# Altium schematic sheet Sch_Sheet_Template.SchDoc: LED Board
size B; Date: MM/DD/YYYY; Author: LED Team; Organization: ORGANIZATION; Address1: ADDRESS 1; Address2: ADDRESS 2; Address3: ADDRESS 3; Address4: ADDRESS 4; Revision: -; SheetNumber: 1; SheetTotal: 1; ENG_APP_DATE: --/--/--; DSN_APP_DATE: --/--/--; CHK_APP_DATE: --/--/--
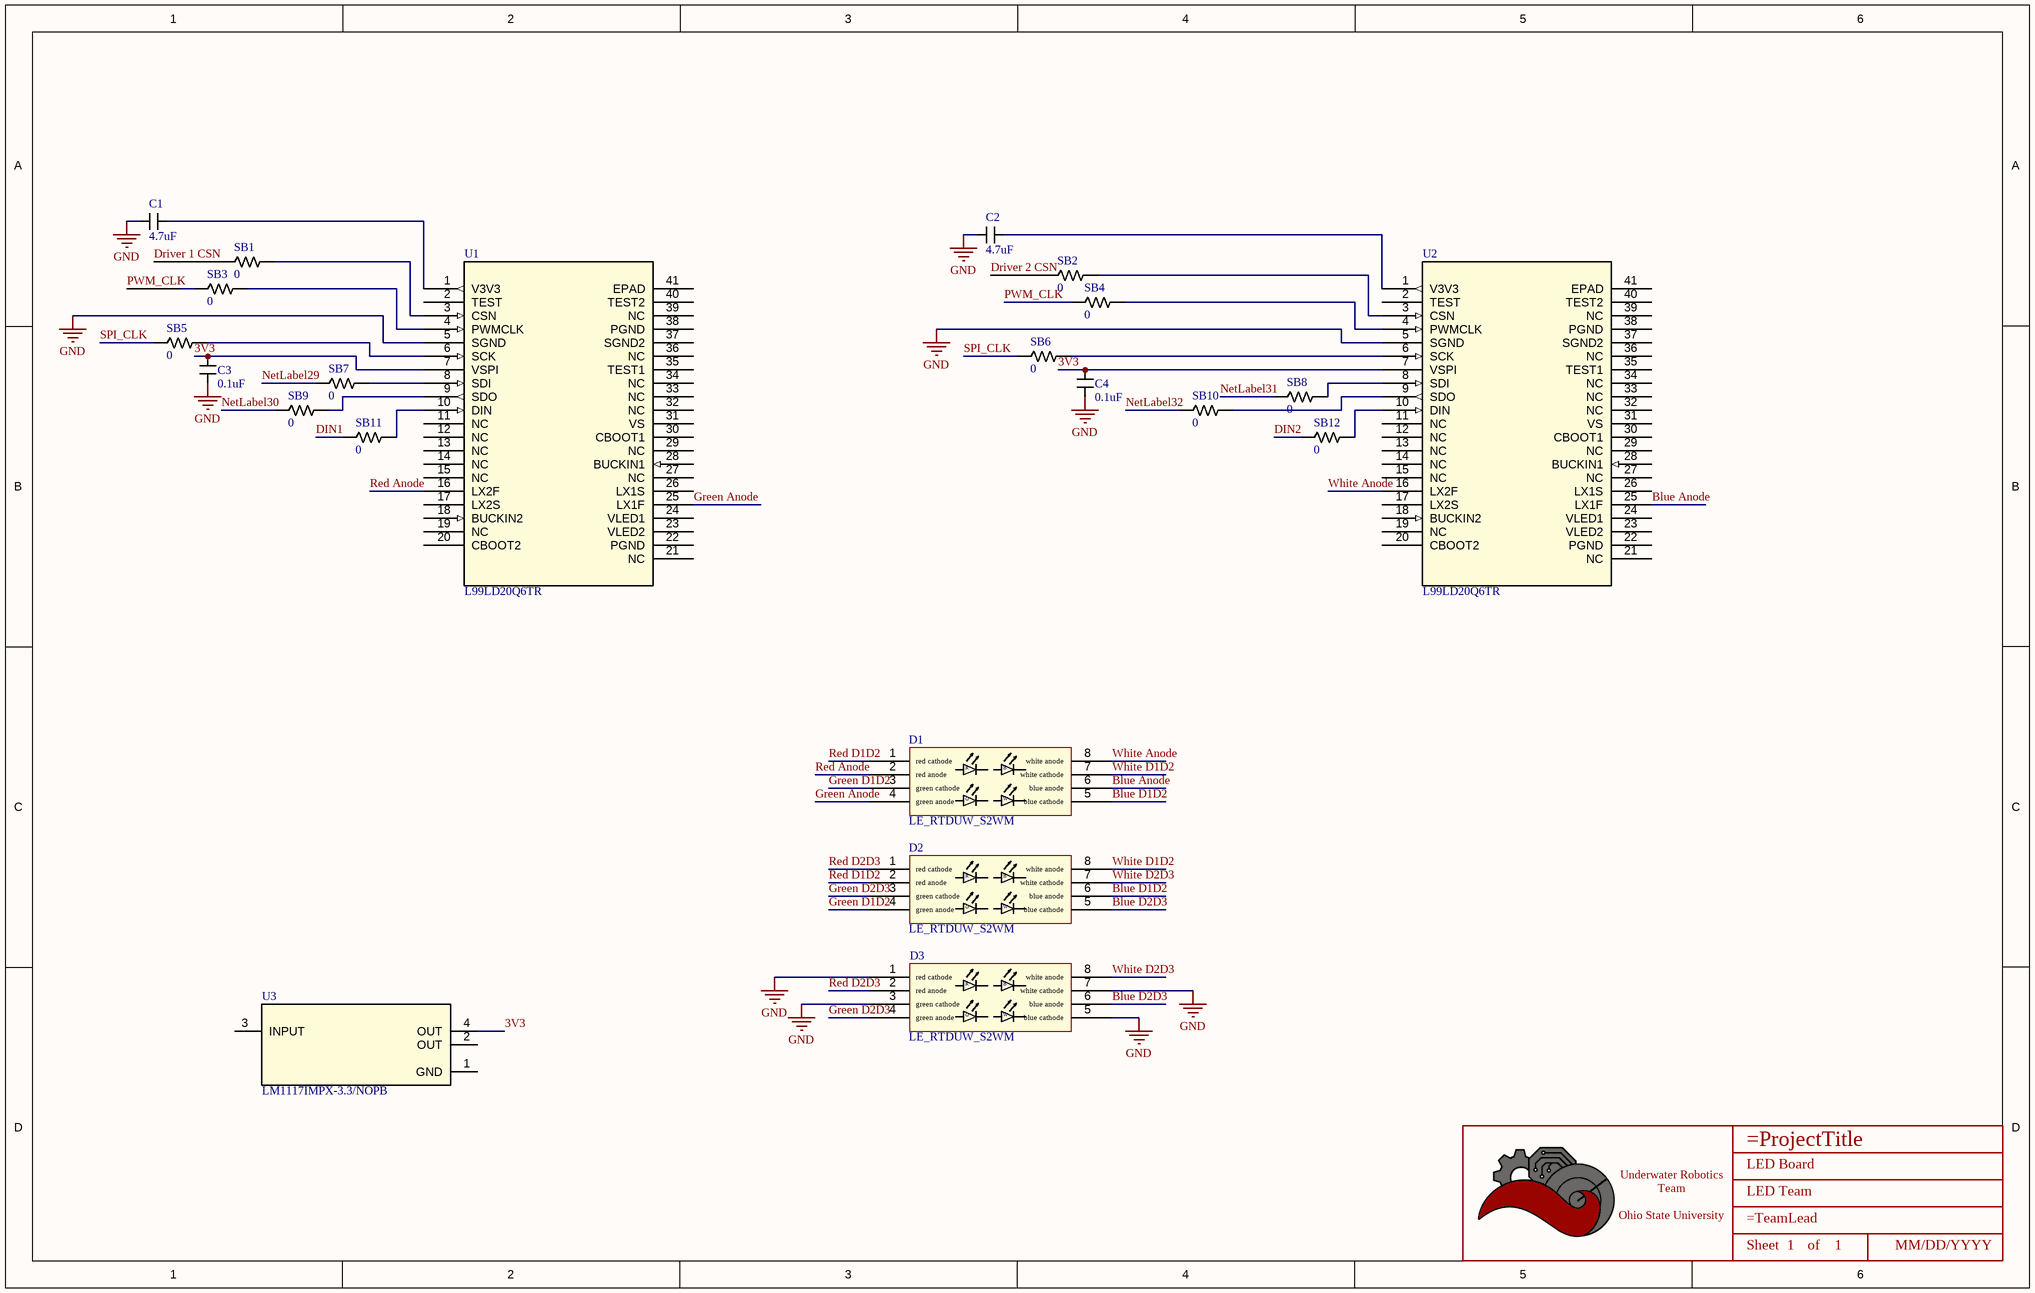
[diagram p0: Sch_Sheet_Template.SchDoc]

## Parts
*  Title_Block  [LOGO]  (value not drawn)  (graphical)
C1  value 4.7uF  [CAPACITOR_0603]  (hidden comment: 4.7uF Ceramic 6.3V)
C2  value 4.7uF  [CAPACITOR_0603]  (hidden comment: 4.7uF Ceramic 6.3V)
C3  value 0.1uF  [CAPACITOR_0603]  (hidden comment: 100nF Ceramic 6.3V)
C4  value 0.1uF  [CAPACITOR_0603]  (hidden comment: 100nF Ceramic 6.3V)
D1  LE_RTDUW_S2WM
D2  LE_RTDUW_S2WM
D3  LE_RTDUW_S2WM
SB1  Value  (Ohms): 0  [RESISTOR_0603]  (hidden comment: 0 Ohm Jumper No Fit)
SB2  Value  (Ohms): 0  [RESISTOR_0603]  (hidden comment: 0 Ohm Jumper No Fit)
SB3  Value  (Ohms): 0  [RESISTOR_0603]  (hidden comment: 0 Ohm Jumper No Fit)
SB4  Value  (Ohms): 0  [RESISTOR_0603]  (hidden comment: 0 Ohm Jumper No Fit)
SB5  Value  (Ohms): 0  [RESISTOR_0603]  (hidden comment: 0 Ohm Jumper No Fit)
SB6  Value  (Ohms): 0  [RESISTOR_0603]  (hidden comment: 0 Ohm Jumper No Fit)
SB7  Value  (Ohms): 0  [RESISTOR_0603]  (hidden comment: 0 Ohm Jumper No Fit)
SB8  Value  (Ohms): 0  [RESISTOR_0603]  (hidden comment: 0 Ohm Jumper No Fit)
SB9  Value  (Ohms): 0  [RESISTOR_0603]  (hidden comment: 0 Ohm Jumper No Fit)
SB10  Value  (Ohms): 0  [RESISTOR_0603]  (hidden comment: 0 Ohm Jumper No Fit)
SB11  Value  (Ohms): 0  [RESISTOR_0603]  (hidden comment: 0 Ohm Jumper No Fit)
SB12  Value  (Ohms): 0  [RESISTOR_0603]  (hidden comment: 0 Ohm Jumper No Fit)
U1  L99LD20Q6TR  [QFN40L_6P15X6P15X0P5_STM]
U2  L99LD20Q6TR  [QFN40L_6P15X6P15X0P5_STM]
U3  LM1117IMPX-3.3/NOPB  [SOT-223-4]

## Nets
GND: C1.2 C2.2 C3.2 C4.2 D3.1(red_cathode) D3.3(green_cathode) D3.5(blue_cathode) D3.7(white_cathode) U1.5(SGND) U2.5(SGND)
3V3: C3.1 C4.1 U1.7(VSPI) U2.7(VSPI) U3.4(OUT)
Blue Anode: D1.6(blue_anode) U2.25(LX1F)
Blue D1D2: D1.5(blue_cathode) D2.6(blue_anode)
Blue D2D3: D2.5(blue_cathode) D3.6(blue_anode)
DIN1: SB11.2
DIN2: SB12.2
Green Anode: D1.4(green_anode) U1.25(LX1F)
Green D1D2: D1.3(green_cathode) D2.4(green_anode)
Green D2D3: D2.3(green_cathode) D3.4(green_anode)
NetLabel29: SB7.2
NetLabel30: SB9.2
NetLabel31: SB8.2
NetLabel32: SB10.2
PWM_CLK: SB4.2
Red Anode: D1.2(red_anode) U1.16(LX2F)
Red D1D2: D1.1(red_cathode) D2.2(red_anode)
Red D2D3: D2.1(red_cathode) D3.2(red_anode)
SPI_CLK: SB5.2 SB6.2
White Anode: D1.8(white_anode) U2.16(LX2F)
White D1D2: D1.7(white_cathode) D2.8(white_anode)
White D2D3: D2.7(white_cathode) D3.8(white_anode)
NetC1_1: C1.1 U1.1(V3V3)
NetC2_1: C2.1 U2.1(V3V3)
NetSB1_1: SB1.1 U1.3(CSN)
NetSB2_1: SB2.1 U2.3(CSN)
NetSB3_1: SB3.1 U1.4(PWMCLK)
NetSB4_1: SB4.1 U2.4(PWMCLK)
NetSB5_1: SB5.1 U1.6(SCK)
NetSB6_1: SB6.1 U2.6(SCK)
NetSB7_1: SB7.1 U1.8(SDI)
NetSB8_1: SB8.1 U2.8(SDI)
NetSB9_1: SB9.1 U1.9(SDO)
NetSB10_1: SB10.1 U2.9(SDO)
NetSB11_1: SB11.1 U1.10(DIN)
NetSB12_1: SB12.1 U2.10(DIN)

Not connected (* = marked no-connect by the designer): SB1 2; SB2 2; SB3 2; U1 2(TEST) 11(NC) 12(NC) 13(NC) 14(NC) 15(NC) 17(LX2S) 18(BUCKIN2) 19(NC) 20(CBOOT2) 21(NC) 22(PGND) 23(VLED2) 24(VLED1) 26(LX1S) 27(NC) 28(BUCKIN1) 29(NC) 30(CBOOT1) 31(VS) 32(NC) 33(NC) 34(NC) 35(TEST1) 36(NC) 37(SGND2) 38(PGND) 39(NC) 40(TEST2) 41(EPAD); U2 2(TEST) 11(NC) 12(NC) 13(NC) 14(NC) 15(NC) 17(LX2S) 18(BUCKIN2) 19(NC) 20(CBOOT2) 21(NC) 22(PGND) 23(VLED2) 24(VLED1) 26(LX1S) 27(NC) 28(BUCKIN1) 29(NC) 30(CBOOT1) 31(VS) 32(NC) 33(NC) 34(NC) 35(TEST1) 36(NC) 37(SGND2) 38(PGND) 39(NC) 40(TEST2) 41(EPAD); U3 1(GND) 2(OUT) 3(INPUT)

## Notes on the sheet
- Labels drawn without touching a wire or pin: Driver 1 CSN, Driver 2 CSN, PWM_CLK
- DWG. NO.
- REV.
- SHT.
- THIS DOCUMENT AND THE DATA DISCLOSED HEREIN OR HEREWITH IS THE PROPERTY OF ALTIUM LIMITED AND MAY BE FREELY DISTRIBUTED IN WHOLE. NO RIGHTS ARE RESERVED OR EXPRESS OR IMPLIED WARANTEE GIVEN.
- REVISION
- DESCRIPTION
- DATE
- APPROVED
- ENG:
- APPROVALS
- PROJECT
- DSN:
- CHK:
- REFERENCE DOCUMENTS
- PROJECT REVISION:
- TITLE
- DOCUMENT REVISION:
- DESIGN ITEM:
- BOM:
- FAB DWG:
- PCB DWG:
- ASSY DWG:
- SCALE:
- SIZE
- B
- CAGE CODE
- FILE NAME
- DWG NO.
- SHEET
- OF
- REV
- (in symbol LE_RTDUW_S2WM) R; B; G; W
- (in symbol Title_Block) Underwater Robotics Team / Ohio State University; Sheet; of

## Library data of the parts
* = Title_Block: UWRT Schematic Title Block Template / Created June 2021, Dylan Trainor
C1 C2 = CAPACITOR_4.7uF_0603: Cap 4.7uF 6.3V +/-10% / Ceramic 0603; Made By: Robert Pafford; Tolerance: +/- 10%; Voltage: 6.3V; Supplier 1: Digi-Key; Supplier Part Number 1: 1276-2087-1-ND
C3 C4 = CAPACITOR_0.1uF_0603_1: Cap 100nF 6.3V +/-10% / Ceramic 0603; Made By: Flip B; ComponentLink1Description: Datsheet; ComponentLink1URL: https://www.mouser.com/datasheet/2/212/KEM_C1002_X7R_SMD-1102033.pdf; Tolerance: +/- 10%; Voltage: 6.3V; Supplier 1: Digi-Key; Supplier Part Number 1: 399-15351-1-ND
D1-D3 = LE_RTDUW_S2WM: LED OSTAR RGBW 625/527/453NM SMD; Designator: D; Supplier 1: Mouser; Supplier Part Number 1: 720-LERTDUWS2WMA2120
SB1-SB12 = JUMPER_0_0603: 0 Ohm Jumper No Fit for Solder Bridge; Made By: Robert Pafford; ComponentLink1Description: Digikey; ComponentLink1URL: https://www.digikey.com/en/products/detail/koa-speer-electronics-inc/RK73B1JTTD101J/9844701
U1 U2 = L99LD20Q6TR: IC LED DRVR RGLTR PWM 1.5A 40QFN; Mfr_Name: STMicroelectronics; Copyright: Copyright (C) 2023 Ultra Librarian. All rights reserved.; Manufacturer_Part_Number: L99LD20Q6TR; RefDes: RefDes; Type: DEV; Supplier 1: Digi-Key; Supplier Part Number 1: 497-18126-1-ND
U3 = LM1117IMPX-3.3/NOPB: IC REG LIN 3.3V 800MA SOT223-4; PartNumber: LM1117IMP-3.3/NOPB; Manufacturer: Texas Instruments; Vin (Max): 15V; Supplier 1: Digi-Key; Supplier Part Number 1: LM1117IMPX-3.3/NOPBCT-ND; Vout (Min/Fixed): 3.3V; Amp Out: 800mA; Package: SOT-223-4; Created By: Dylan T